# Altium schematic sheet 03_DCDC_BOOST.SchDoc
size 209 x 297 mm; Author: Войлоков В. М.; CompanyName: ВГТУ РП-233; SheetNumber: 3; SheetTotal: 5; DecimalNumber: ВГТУ.436224.001; Name1: Преобразователь; Name2: напряжения к 12В
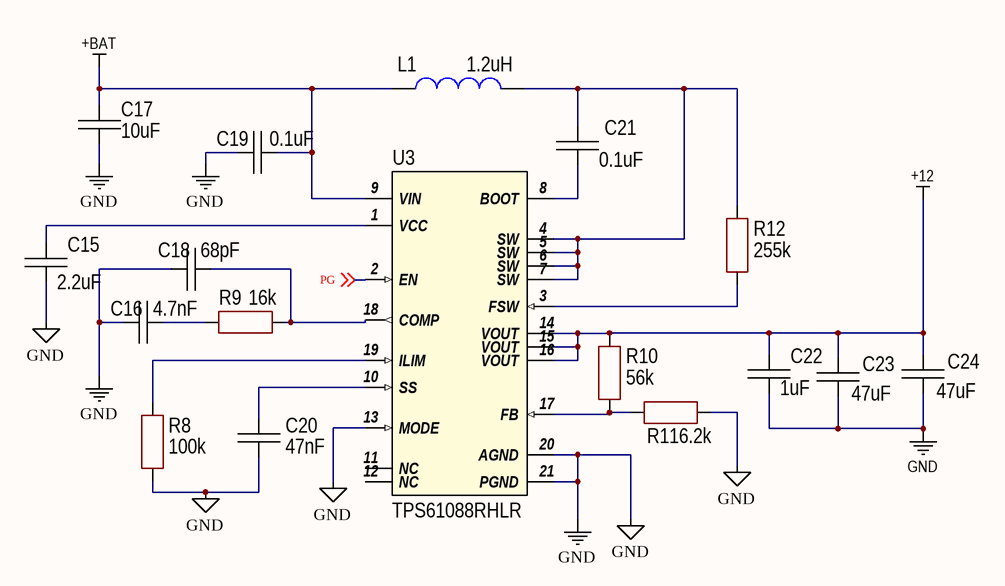
[diagram p0: 03_DCDC_BOOST.SchDoc]

## Parts
C15  value 2.2uF  [CAP: 0805]
C16  value 4.7nF  [CAP: 0805]
C17  value 10uF  [CAP: 1206]
C18  value 68pF  [CAP: 0805]
C19  value 0.1uF  [CAP: 0603]
C20  value 47nF  [CAP: 0603]
C21  value 0.1uF  [CAP: 1210]
C22  value 1uF  [CAP: 0805]
C23  value 47uF  [CAP: 1206]
C24  value 47uF  [CAP: 1206]
L1  value 1.2uH  [IND: SRP1265A]
R8  value 100k  [RES: 0603]
R9  value 16k  [RES: 0603]
R10  value 56k  [RES: 0603]
R11  value 6.2k  [RES: 0603]
R12  value 255k  [RES: 0603]
U3  TPS61088RHLR  [RHL0020A]

## Nets
+12: C22.2 C23.2 C24.2 R10.2 U3.14(VOUT) U3.15(VOUT) U3.16(VOUT)
+BAT: C17.1 C19.1 L1.2 U3.9(VIN)
GND: C15.1 C16.2 C17.2 C18.2 C19.2 C20.1 C22.1 C23.1 C24.1 R8.1 R11.2 U3.13(MODE) U3.20(AGND) U3.21(PGND)
PG: U3.2(EN) ; off-sheet PG
NetC15_2: C15.2 U3.1(VCC)
NetC16_1: C16.1 R9.1
NetC18_1: C18.1 R9.2 U3.18(COMP)
NetC20_2: C20.2 U3.10(SS)
NetC21_1: C21.1 U3.8(BOOT)
NetC21_2: C21.2 L1.1 R12.2 U3.4(SW) U3.5(SW) U3.6(SW) U3.7(SW)
NetR8_2: R8.2 U3.19(ILIM)
NetR10_1: R10.1 R11.1 U3.17(FB)
NetR12_1: R12.1 U3.3(FSW)

Not connected (* = marked no-connect by the designer): U3 11(NC) 12(NC)

## Notes on the sheet
- Перв.примен.
- Справ.№
- Подп. и дата
- Инв.№ дубл.
- Взам.инв.№
- Подп.и дата
- Разраб.
- Изм.
- Лист
- № докум.
- Подп.
- Дата
- Лит.
- Масштаб
- Масса
- Т.контр.
- Пров.
- СХЕМА   ЭЛЕКТРИЧЕСКАЯ
- ПРИНЦИПИАЛЬНАЯ
- Листов
- Инв.№ подл.
- Утв.
- Н.контр.
- Нач.сект.

## Library data of the parts
C15 = Ceramic_0805: Manufacturer: Yageo; PartNumber: CC0805KRX7R7BB104; ValueManufacturerPartNumber: Ceramic capacitor, 2.2uF, X7R, ±10%, 16V, 0805, -55...+125°C; TypeCapacitor: Ceramic capacitor; Tolerance: ±10%; TypeDielectric: X7R; Voltage: 16V; Package: 0805; HelpURL: https://www.digikey.com/product-detail/en/yageo/CC0805KRX7R7BB104/311-1142-1-ND/303052; Temperature: -55...+125°C
C16 = Ceramic_0805: Manufacturer: Yageo; PartNumber: CC0805KRX7R7BB104; ValueManufacturerPartNumber: Ceramic capacitor, 4.7nF, X7R, ±10%, 16V, 0805, -55...+125°C; TypeCapacitor: Ceramic capacitor; Tolerance: ±10%; TypeDielectric: X7R; Voltage: 16V; Package: 0805; HelpURL: https://www.digikey.com/product-detail/en/yageo/CC0805KRX7R7BB104/311-1142-1-ND/303052; Temperature: -55...+125°C
C17 = Ceramic_1206: Manufacturer: Yageo; PartNumber: CC1206KRX7R9BB104; ValueManufacturerPartNumber: Ceramic capacitor, 10uF, X7R, ±10%, 50V, 1206, -55...+125°C; TypeCapacitor: Ceramic capacitor; Tolerance: ±10%; TypeDielectric: X7R; Voltage: 50V; Package: 1206; HelpURL: https://www.digikey.com/product-detail/en/yageo/CC1206KRX7R9BB104/311-1179-1-ND/303089; Temperature: -55...+125°C
C18 = Ceramic_0805: Manufacturer: Yageo; PartNumber: CC0805KRX7R7BB104; ValueManufacturerPartNumber: Ceramic capacitor, 68pF, X7R, ±10%, 16V, 0805, -55...+125°C; TypeCapacitor: Ceramic capacitor; Tolerance: ±10%; TypeDielectric: X7R; Voltage: 16V; Package: 0805; HelpURL: https://www.digikey.com/product-detail/en/yageo/CC0805KRX7R7BB104/311-1142-1-ND/303052; Temperature: -55...+125°C
C19 = Ceramic_0603: Manufacturer: Yageo; PartNumber: CC0603KRX7R7BB104; ValueManufacturerPartNumber: Ceramic capacitor, 0.1uF, X7R, ±10%, 16V, 0603, -55...+125°C; TypeCapacitor: Ceramic capacitor; Tolerance: ±10%; TypeDielectric: X7R; Voltage: 16V; Package: 0603; HelpURL: https://www.digikey.com/product-detail/en/yageo/CC0603KRX7R7BB104/311-1088-1-ND/302998; Temperature: -55...+125°C
C20 = Ceramic_0603: Manufacturer: Yageo; PartNumber: CC0603KRX7R7BB104; ValueManufacturerPartNumber: Ceramic capacitor, 47nF, X7R, ±10%, 16V, 0603, -55...+125°C; TypeCapacitor: Ceramic capacitor; Tolerance: ±10%; TypeDielectric: X7R; Voltage: 16V; Package: 0603; HelpURL: https://www.digikey.com/product-detail/en/yageo/CC0603KRX7R7BB104/311-1088-1-ND/302998; Temperature: -55...+125°C
C21 = Ceramic_1210: Manufacturer: Yageo; PartNumber: CC1210KKX7R9BB104; ValueManufacturerPartNumber: Ceramic capacitor, 0.1uF, X7R, ±10%, 50V, 1210, -55...+125°C; TypeCapacitor: Ceramic capacitor; Tolerance: ±10%; TypeDielectric: X7R; Voltage: 50V; Package: 1210; HelpURL: https://www.digikey.com/product-detail/en/yageo/CC1210KKX7R9BB104/311-4522-1-ND/8025611; Temperature: -55...+125°C
C22 = Ceramic_0805: Manufacturer: Yageo; PartNumber: CC0805KRX7R7BB104; ValueManufacturerPartNumber: Ceramic capacitor, 1uF, X7R, ±10%, 16V, 0805, -55...+125°C; TypeCapacitor: Ceramic capacitor; Tolerance: ±10%; TypeDielectric: X7R; Voltage: 16V; Package: 0805; HelpURL: https://www.digikey.com/product-detail/en/yageo/CC0805KRX7R7BB104/311-1142-1-ND/303052; Temperature: -55...+125°C
C23 C24 = Ceramic_1206: Manufacturer: Yageo; PartNumber: CC1206KRX7R9BB104; ValueManufacturerPartNumber: Ceramic capacitor, 47uF, X7R, ±10%, 50V, 1206, -55...+125°C; TypeCapacitor: Ceramic capacitor; Tolerance: ±10%; TypeDielectric: X7R; Voltage: 50V; Package: 1206; HelpURL: https://www.digikey.com/product-detail/en/yageo/CC1206KRX7R9BB104/311-1179-1-ND/303089; Temperature: -55...+125°C
L1 = Inductor_SRP1265A: Manufacturer: Bourns; PartNumber: SRP1265A-4R7M; ValueManufacturerPartNumber: Fixed inductor, 1.2uH, ±20%, SRP1265A, 13.5A, -40...+150°C; TypeInductor: Fixed inductor; MaxCurrent: 13.5A; Tolerance: ±20%; Package: SRP1265A; HelpURL: https://www.digikey.com/product-detail/en/bourns-inc/SRP1265A-4R7M/SRP1265A-4R7MCT-ND/4876721; Temperature: -40...+150°C
R8 = Resistor_0603: Manufacturer: Yageo; PartNumber: RC0603JR-07100RL; ValueManufacturerPartNumber: Resistor film, 100k, ±5%, 0603, 0.1W, -55...+125°C; TypeResistor: Resistor film; Power: 0.1W; Tolerance: ±5%; Package: 0603; HelpURL: https://www.digikey.com/product-detail/en/yageo/RC0603JR-07100RL/311-100GRCT-ND/729644; Temperature: -55...+125°C
R9 = Resistor_0603: Manufacturer: Yageo; PartNumber: RC0603JR-07100RL; ValueManufacturerPartNumber: Resistor film, 16k, ±5%, 0603, 0.1W, -55...+125°C; TypeResistor: Resistor film; Power: 0.1W; Tolerance: ±5%; Package: 0603; HelpURL: https://www.digikey.com/product-detail/en/yageo/RC0603JR-07100RL/311-100GRCT-ND/729644; Temperature: -55...+125°C
R10 = Resistor_0603: Manufacturer: Yageo; PartNumber: RC0603JR-07100RL; ValueManufacturerPartNumber: Resistor film, 56k, ±5%, 0603, 0.1W, -55...+125°C; TypeResistor: Resistor film; Power: 0.1W; Tolerance: ±5%; Package: 0603; HelpURL: https://www.digikey.com/product-detail/en/yageo/RC0603JR-07100RL/311-100GRCT-ND/729644; Temperature: -55...+125°C
R11 = Resistor_0603: Manufacturer: Yageo; PartNumber: RC0603JR-07100RL; ValueManufacturerPartNumber: Resistor film, 6.2k, ±5%, 0603, 0.1W, -55...+125°C; TypeResistor: Resistor film; Power: 0.1W; Tolerance: ±5%; Package: 0603; HelpURL: https://www.digikey.com/product-detail/en/yageo/RC0603JR-07100RL/311-100GRCT-ND/729644; Temperature: -55...+125°C
R12 = Resistor_0603: Manufacturer: Yageo; PartNumber: RC0603JR-07100RL; ValueManufacturerPartNumber: Resistor film, 255k, ±5%, 0603, 0.1W, -55...+125°C; TypeResistor: Resistor film; Power: 0.1W; Tolerance: ±5%; Package: 0603; HelpURL: https://www.digikey.com/product-detail/en/yageo/RC0603JR-07100RL/311-100GRCT-ND/729644; Temperature: -55...+125°C
U3 = TPS61088RHLR: 10-A Fully-Integrated Synchronous Boost Converter 20-VQFN -40 to 125; Manufacturer_Name: Texas Instruments; Alternate_PartNumber: TPS61088RHLT; CompType: IC; TYPE: TYPE; RefDes: RefDes; Copyright: Copyright (C) 2026 Ultra Librarian. All rights reserved.; Manufacturer_Part_Number: TPS61088RHLR; Application_BuildNumber: *; PartNumber: TPS61088RHLR; PackageReference: RHL0020A; MountType: SMT; RoHS: Y; Manufacturer: Texas Instruments